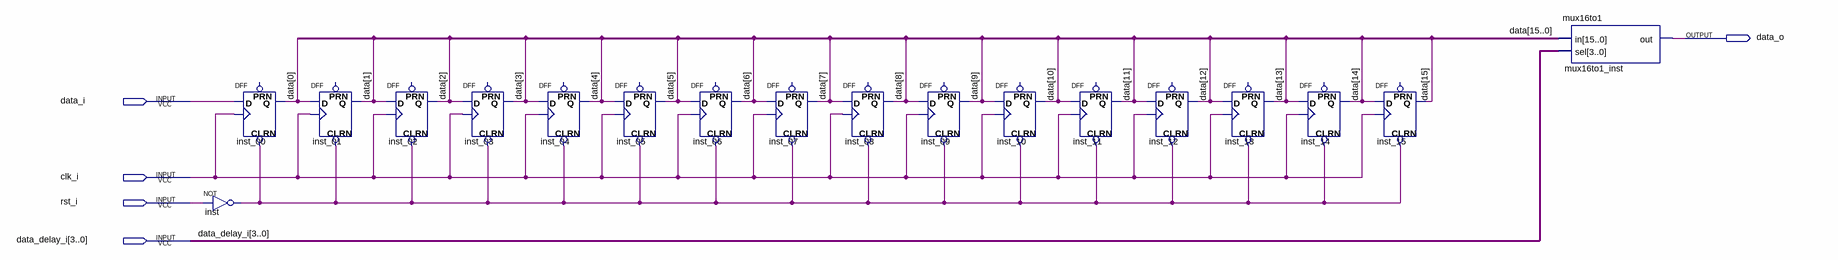
[diagram p0: schematic sheet]
// Quartus schematic delay_line.bdf as structural Verilog: 18 symbols, 5 pins
module delay_line (
  input  data_i,
  input  clk_i,
  input  rst_i,
  input  [3:0] data_delay_i,
  output data_o
);

  wire inst_out;
  wire [15:0] data;

  not inst (inst_out, rst_i);
  DFF inst_00 (.CLRN(inst_out), .CLK(clk_i), .D(data_i), .Q(data[0]));  // open: PRN
  DFF inst_01 (.CLRN(inst_out), .CLK(clk_i), .D(data[0]), .Q(data[1]));  // open: PRN
  DFF inst_02 (.CLRN(inst_out), .CLK(clk_i), .D(data[1]), .Q(data[2]));  // open: PRN
  DFF inst_03 (.CLRN(inst_out), .CLK(clk_i), .D(data[2]), .Q(data[3]));  // open: PRN
  DFF inst_04 (.CLRN(inst_out), .CLK(clk_i), .D(data[3]), .Q(data[4]));  // open: PRN
  DFF inst_05 (.CLRN(inst_out), .CLK(clk_i), .D(data[4]), .Q(data[5]));  // open: PRN
  DFF inst_06 (.CLRN(inst_out), .CLK(clk_i), .D(data[5]), .Q(data[6]));  // open: PRN
  DFF inst_07 (.CLRN(inst_out), .CLK(clk_i), .D(data[6]), .Q(data[7]));  // open: PRN
  DFF inst_08 (.CLRN(inst_out), .CLK(clk_i), .D(data[7]), .Q(data[8]));  // open: PRN
  DFF inst_09 (.CLRN(inst_out), .CLK(clk_i), .D(data[8]), .Q(data[9]));  // open: PRN
  DFF inst_10 (.CLRN(inst_out), .CLK(clk_i), .D(data[9]), .Q(data[10]));  // open: PRN
  DFF inst_11 (.CLRN(inst_out), .CLK(clk_i), .D(data[10]), .Q(data[11]));  // open: PRN
  DFF inst_12 (.CLRN(inst_out), .CLK(clk_i), .D(data[11]), .Q(data[12]));  // open: PRN
  DFF inst_13 (.CLRN(inst_out), .CLK(clk_i), .D(data[12]), .Q(data[13]));  // open: PRN
  DFF inst_14 (.CLRN(inst_out), .CLK(clk_i), .D(data[13]), .Q(data[14]));  // open: PRN
  DFF inst_15 (.CLRN(inst_out), .CLK(clk_i), .D(data[14]), .Q(data[15]));  // open: PRN
  mux16to1 mux16to1_inst (.in(data), .sel(data_delay_i), .out(data_o));
endmodule
